# EAGLE design Tracksoar v1.2 active gps (EAGLE 7.3.0)
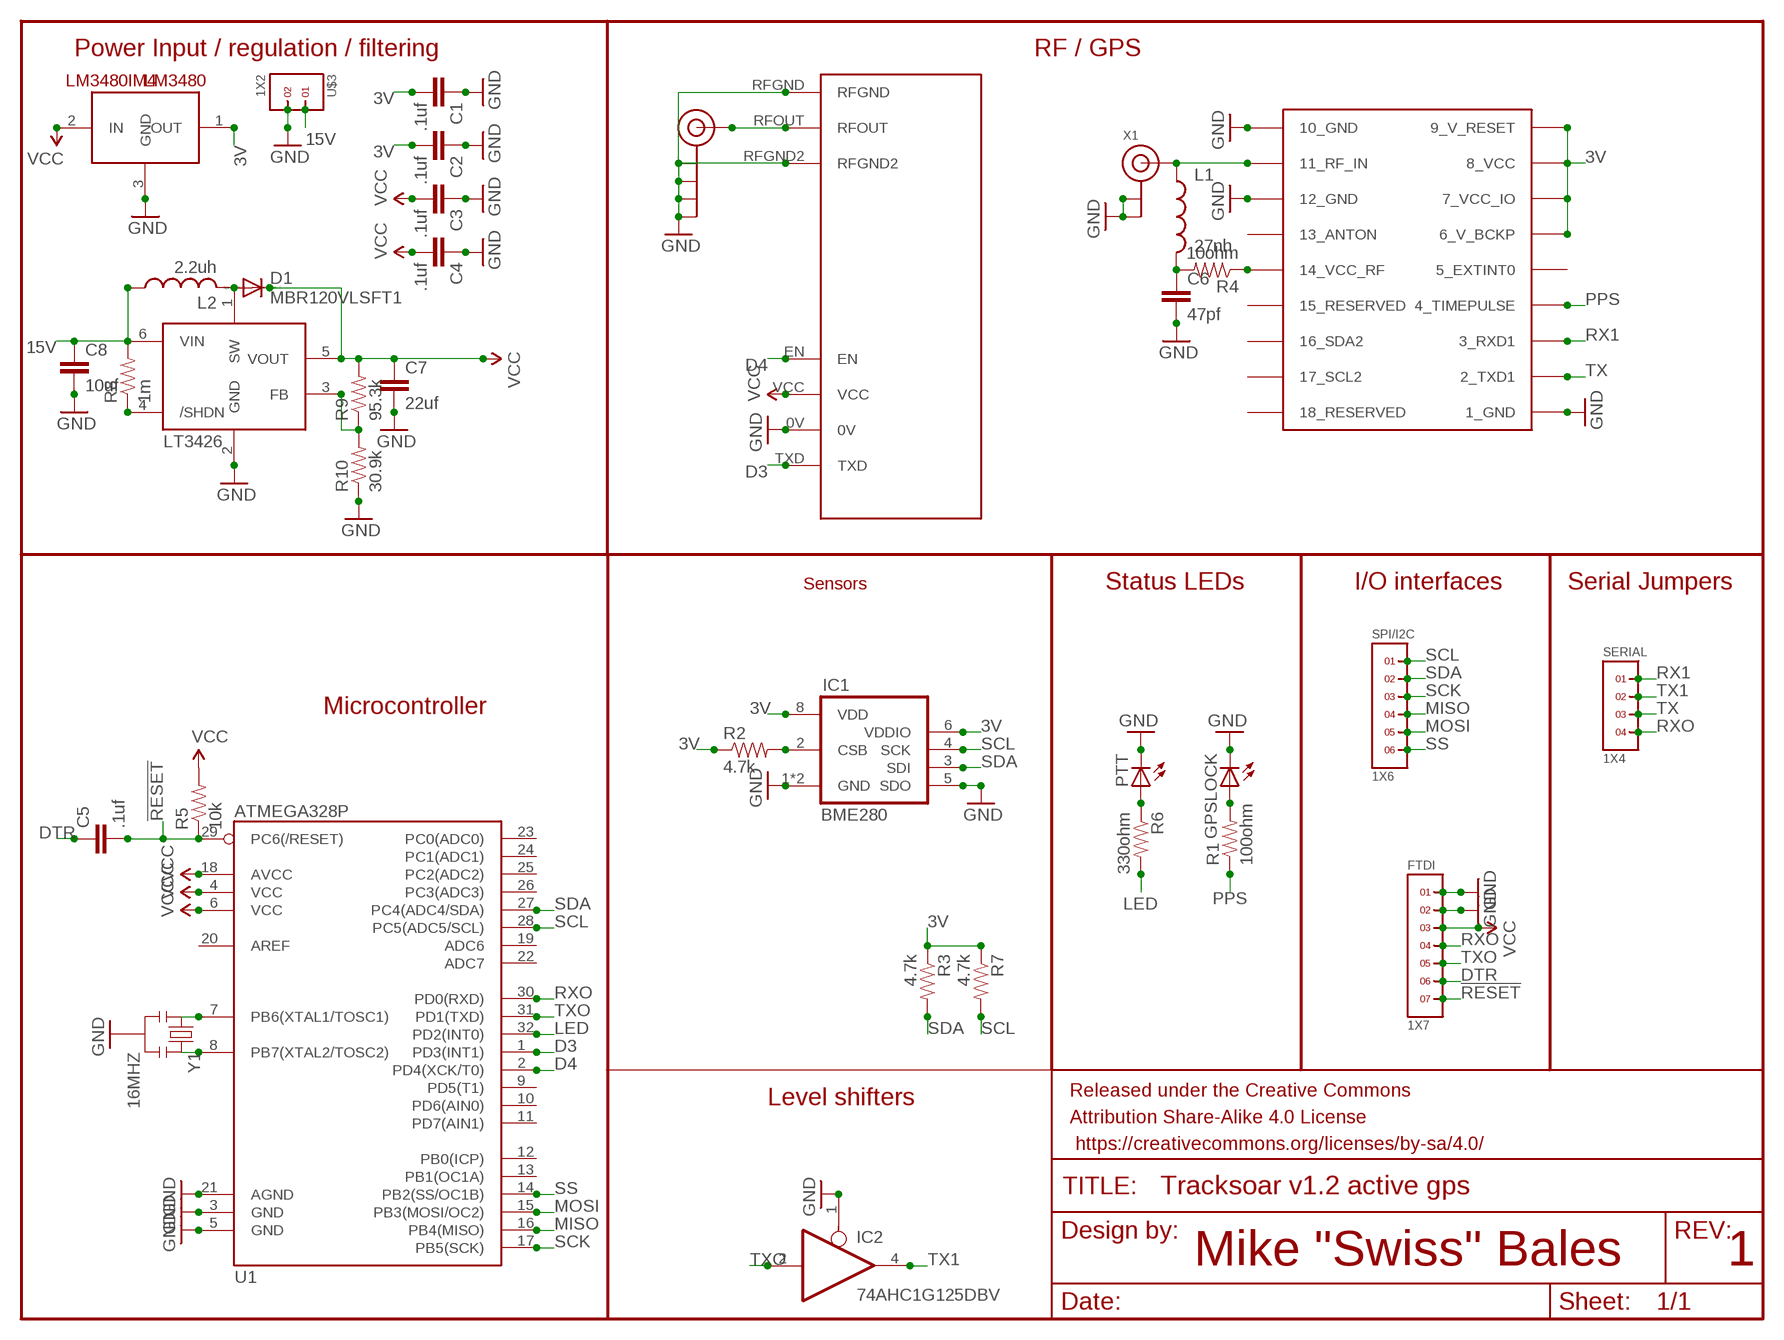
[diagram p0: schematic, sheet 1]

## Parts
C1  .1uf  CAP0805  [0805]
C2  .1uf  CAP0805  [0805]
C3  .1uf  CAP0805  [0805]
C4  .1uf  CAP0805  [0805]
C5  .1uf  CAP0805  [0805]
C6  47pf  CAP0805  [0805]
C7  22uf  CAP0805  [0805]
C8  10uf  CAP0805  [0805]
D1  MBR120VLSFT1  DIODE-SOD123  [SOD123]
FRAME1  FRAME-LETTER  [CREATIVE_COMMONS]
FTDI  1X7  [1X7]
GPSLOCK  LEDCHIP-LED0805  [CHIP-LED0805]
IC1  BME280  [BME280]
IC2  74AHC1G125DBV  [SOT23-5]
J$1  SMA_EDGE  [SMA-EDGE]
L1  27nh  INDUCTOR0805  [0805]
L2  2.2uh  L-USL1812  [L1812]
LM3480  LM3480IM4  [SOT23-3]
LT3426  LT3426  [SOT23-6]
PTT  LEDCHIP-LED0805  [CHIP-LED0805]
R1  100ohm  RESISTOR0805-RES  [0805]
R2  4.7k  RESISTOR0805-RES  [0805]
R3  4.7k  RESISTOR0805-RES  [0805]
R4  10ohm  RESISTOR0805-RES  [0805]
R5  10k  RESISTOR0805-RES  [0805]
R6  330ohm  RESISTOR0805-RES  [0805]
R7  4.7k  RESISTOR0805-RES  [0805]
R8  1m  RESISTOR0805-RES  [0805]
R9  95.3k  RESISTOR0805-RES  [0805]
R10  30.9k  RESISTOR0805-RES  [0805]
SERIAL  1X4  [1X4]
SPI/I2C  1X6  [1X6]
U1  ATMEGA328P  ATMEGA168MLF  [MLF32]
U$1  UBLOX_MAX  [UBLOX_MAX]
U$2  RADIOMETRIX-HX1  [RADIOMETRIX-HX1]
U$3  1X2  [1X2]
X1  ANTENNA_U.FL  [U.FL]
Y1  16MHZ  RESONATOR16MHZ  [RESONATOR-SMD]

## Nets
3V: C1.2 C2.2 IC1.6(VDDIO) IC1.8(VDD) LM3480.1(OUT) R2.1 R3.1 R7.1 U$1.6_V_BCKP U$1.7_VCC_IO U$1.8_VCC U$1.9_V_RESET
15V: C8.1 L2.1 LT3426.6(VIN) R8.2 U$3.1
!RESET: C5.2 FTDI.7 R5.1 U1.29(PC6(/RESET))
D3: U1.1(PD3(INT1)) U$2.TXD
D4: U1.2(PD4(XCK/T0)) U$2.EN
DTR: C5.1 FTDI.6
GND: C1.1 C2.1 C3.1 C4.1 C6.2 C7.2 C8.2 FTDI.1 FTDI.2 GPSLOCK.C IC1.1(GND) IC1.5(SDO) IC1.7(GND) IC2.1(OE) J$1.GND@0(GND) J$1.GND@1(GND) J$1.GND@2(GND) J$1.GND@3(GND) LM3480.3(GND) LT3426.2(GND) PTT.C R10.1 U1.3(GND) U1.5(GND) U1.21(AGND) U$1.1_GND U$1.10_GND U$1.12_GND U$2.0V U$2.RFGND U$2.RFGND2 U$3.2 X1.1(GND) X1.2(GND) Y1.2
LED: R6.2 U1.32(PD2(INT0))
MISO: SPI/I2C.4 U1.16(PB4(MISO))
MOSI: SPI/I2C.5 U1.15(PB3(MOSI/OC2))
N$1: J$1.SIG(SIGNAL) U$2.RFOUT
N$2: IC1.2(CSB) R2.2
N$3: GPSLOCK.A R1.2
N$6: L1.1 U$1.11_RF_IN X1.3(SIGNAL)
N$7: C6.1 L1.2 R4.2
N$8: R4.1 U$1.14_VCC_RF
N$9: D1.A L2.2 LT3426.1(SW)
N$12: LT3426.4(/SHDN) R8.1
N$13: LT3426.3(FB) R9.1 R10.2
N$14: U1.8(PB7(XTAL2/TOSC2)) Y1.3
N$26: U1.7(PB6(XTAL1/TOSC1)) Y1.1
N$27: PTT.A R6.1
PPS: R1.1 U$1.4_TIMEPULSE
RX1: SERIAL.1 U$1.3_RXD1
RXO: FTDI.4 SERIAL.4 U1.30(PD0(RXD))
SCK: SPI/I2C.3 U1.17(PB5(SCK))
SCL: IC1.4(SCK) R7.2 SPI/I2C.1 U1.28(PC5(ADC5/SCL))
SDA: IC1.3(SDI) R3.2 SPI/I2C.2 U1.27(PC4(ADC4/SDA))
SS: SPI/I2C.6 U1.14(PB2(SS/OC1B))
TX: SERIAL.3 U$1.2_TXD1
TX1: IC2.4(O) SERIAL.2
TXO: FTDI.5 IC2.2(I) U1.31(PD1(TXD))
VCC: C3.2 C4.2 C7.1 D1.C FTDI.3 LM3480.2(IN) LT3426.5(VOUT) R5.2 R9.2 U1.4(VCC) U1.6(VCC) U1.18(AVCC) U$2.VCC
Unconnected: U1.9(PD5(T1)) U1.10(PD6(AIN0)) U1.11(PD7(AIN1)) U1.12(PB0(ICP)) U1.13(PB1(OC1A)) U1.19(ADC6) U1.20(AREF) U1.22(ADC7) U1.23(PC0(ADC0)) U1.24(PC1(ADC1)) U1.25(PC2(ADC2)) U1.26(PC3(ADC3)) U$1.5_EXTINT0 U$1.13_ANTON U$1.15_RESERVED U$1.16_SDA2 U$1.17_SCL2 U$1.18_RESERVED

## Notes on the sheet
- Power Input / regulation / filtering | RF / GPS
- Sensors | Status LEDs | I/O interfaces | Serial Jumpers
- Microcontroller
- Level shifters
- Mike "Swiss" Bales | 1

## Power pins joined to a net without a drawn wire
GND: IC2.3(GND)
VCC: IC2.5(VCC)

## Library data of the parts
C1-C5 C7 C8 = SparkFun-Capacitors:CAP: Capacitor Standard 0603 ceramic capacitor, and 0.1" leaded capacitor.
C6 = SparkFun-Passives:CAP: Capacitor Standard 0603 ceramic capacitor, and 0.1" leaded capacitor.
D1 = diode:DIODE-: DIODE
FRAME1 = SparkFun-Aesthetics:FRAME-LETTER: Schematic Frame Standard 8.5x11 US Letter frame
FTDI = headers(2mm):1X7
GPSLOCK PTT = adafruit:LED: LED OSRAM: - CHIPLED LG R971, LG N971, LY N971, LG Q971, LY Q971, LO R971, LY R971 LH N974, LH R974 LS Q976, LO Q976, LY Q976 LO Q996 - Hyper CHIPLED LW Q18S LB Q993, LB Q99A, LB R99A - SideLED LS A670, LO A670, LY A670, LG A670, LP A670 LB A673, LV A673, LT A673, LW A673 LH A674 LY A675 LS A676, LA A676, LO A676, LY A676, LW A676 LS A679, LY A679, LG A679 - Hyper Micro SIDELED® LS Y876, LA Y876, LO Y876, LY Y876 LT Y87S - SmartLED LW L88C, LW L88S LB L89C, LB L89S, LG L890 LS L89K, LO L89K, LY L89K LS L896, LA L896, LO L896, LY L896 - TOPLED LS T670, LO T670, LY T670, LG T670, LP T670 LSG T670, LSP T670, LSY T670, LOP T670, LYG T670 LG T671, LOG T671, LSG T671 LB T673, LV T673, LT T673, LW T673 LH T674 LS T676, LA T676, LO T676, LY T676, LB T676, LH T676, LSB T676, LW T676 LB T67C, LV T67C, LT T67C, LS T67K, LO T67K, LY T67K, LW E67C LS E67B, LA E67B, LO E67B, LY E67B, LB E67C, LV E67C, LT E67C LW T67C LS T679, LY T679, LG T679 LS T770, LO T770, LY T770, LG T770, LP T770 LB T773, LV T773, LT T773, LW T773 LH T774 LS E675, LA E675, LY E675, LS T675 LS T776, LA T776, LO T776, LY T776, LB T776 LHGB T686 LT T68C, LB T68C - Hyper Mini TOPLED® LB M676 - Mini TOPLED Santana® LG M470 LS M47K, LO M47K, LY M47K Source: http://www.osram.convergy.de/
IC1 = bosch-bme280:BME280: DIGITAL HUMIDITY, PRESSURE AND TEMPERATURE SENSOR * Digital interface I²C (up to 3.4 MHz) and SPI (3 and 4 wire, up to 10 MHz)* Supply voltage VDD main supply voltage range: 1.71 V to 3.6 V*VDDIO interface voltage range: 1.2 V to 3.6 V Operating range -40…+85 °C, 0…100 % rel. humidity, 300…1100 hPa The library has been designed by Richard Magdycz <https://www.facebook.com/groups/eaglecadsoftUK>
IC2 = 74xx-little-us:74*1G125: Single Bus Buffer Gate with 3-State Output
J$1 = SparkFun-Connectors:SMA_EDGE: SMA Antenna Connector End launch SMA connector. The paste layer has been removed so that the connector can be hand soldered onto the board after reflow.
L1 = SparkFun-Passives:INDUCTOR: Inductors Basic Inductor/Choke - 0603 and 1206. Footprints are not proven and vary greatly between part numbers. INDUCTOR POWER 3.3UH 4.0A SMD 0.197" L x 0.197" W x 0.177" H (5.00mm x 5.00mm x 4.50mm)
L2 = resistor:L-US: INDUCTOR, American symbol
LM3480 = SparkFun-PowerIC:LM3480IM4: Small package linear regulator
LT3426 = adafruit:LT3426: LT3426 1.2MHz, 2A boost converter in SOT-23 http://www.linear.com/pc/productDetail.jsp?navId=H0,C1,C1003,C1042,C1031,C1061,P8430 (Linear website)
R1-R3 R5-R10 = SparkFun-Resistors:RESISTOR: Resistor Basic schematic elements and footprints for 0603, 1206, and PTH resistors.
R4 = SparkFun-Passives:RESISTOR: Resistor Basic schematic elements and footprints for 0603, 1206, and PTH resistors.
SERIAL = headers(2mm):1X4
SPI/I2C = headers(2mm):1X6
U1 = SparkFun-DigitalIC:ATMEGA168: Atmel 32-pin 8-bit micro, 16k flash.
U$1 = Ava:UBLOX_MAX: UBLOX MAX
U$2 = Ava:RADIOMETRIX-HX1
U$3 = headers(2mm):1X2
X1 = adafruit:ANTENNA_U.FL: U.FL Antenna Connector
Y1 = SparkFun-FreqCtrl:RESONATOR: Resonator Small SMD resonator. Used, eg, on the Arduino Pro/ Pro Mini boards. 8MHz- XTAL-08895 16MHz- XTAL-08900; PROD_ID: XTAL-08900

## Board
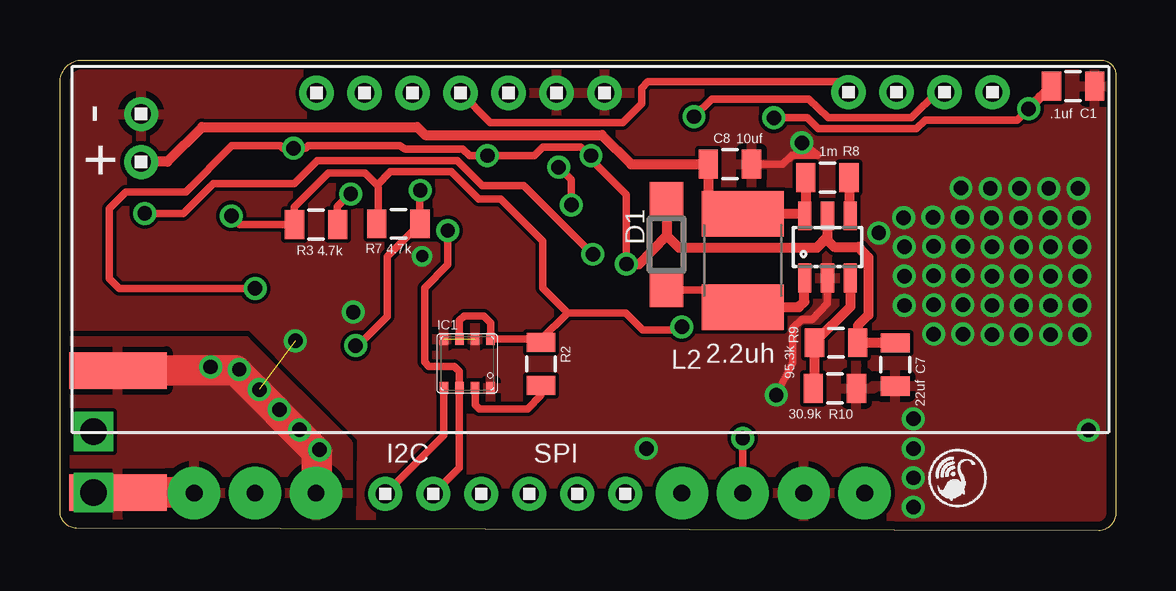
[diagram p1: board, top side]
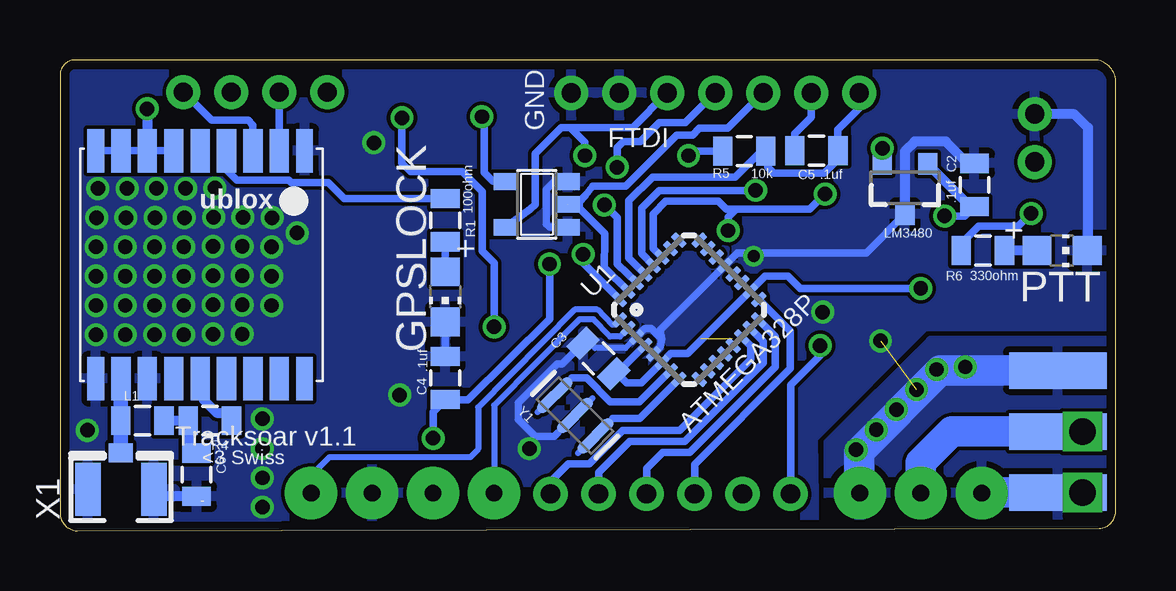
[diagram p2: board, bottom side, seen from below]

Size 43.99 x 19.64 mm. Coordinates in mm from the lower left corner, seen from the top.
Outline: 0.69,0.1 arc-90 0,0.86 0,18.77 arc-90 0.99,19.63 43.38,19.63 arc-90 43.99,18.97 43.99,0.79 arc-90 43.28,0 0.69,0.1
Copper layers (1*16): Top 0.0356mm / dielectric 1.5011mm / Bottom 0.0356mm
Design rules "oshpark-2layer": minimum track width 6mil, minimum drill 13mil, track to track 6mil, track to pad 6mil, pad to pad 6mil, via to via 6mil, smd to smd 6mil, copper to edge 15mil, drill to drill 6mil, minimum pad ring 7mil, minimum via ring 7mil, stop-mask expansion 4mil, vias tented up to drill 0mil, thermal gap 10mil

### Footprints (pad centres in the part's own frame; a part is rotated, then mirrored left to right if it is on the bottom)
0805 = smd 0.8 x 1.2: 1 -0.9,0; 2 0.9,0
SOD123 = smd 1.4 x 1.4: A 1.9,0; C -1.9,0
1X7 = drill 0.8 pad 1.422: 1 -6,0; 2 -4,0; 3 -2,0; 4 0,0; 5 2,0; 6 4,0; 7 6,0
CHIP-LED0805 = smd 1.2 x 1.2: A 0,-1.05; C 0,1.05
BME280 = smd 0.35 x 0.5: 1 0.975,-1.025; 2 0.325,-1.025; 3 -0.325,-1.025; 4 -0.975,-1.025; 5 -0.975,1.025; 6 -0.325,1.025; 7 0.325,1.025; 8 0.975,1.025
SOT23-5 = smd 0.69 x 0.99: 1 -0.95,-1.29; 2 0,-1.29; 3 0.95,-1.29; 4 0.95,1.3; 5 -0.95,1.3
SMA-EDGE = smd 1.524 x 4.064: GND@0 0,0; GND@1 5.08,0; SIG 2.54,0 | smd 1.524 x 4.064 bottom: GND@2 0,0; GND@3 5.08,0
L1812 = smd 1.9 x 3.4: 1 -1.95,0; 2 1.95,0
SOT23-3 = smd 0.8 x 0.9: 1 -0.95,-1; 2 0.95,-1; 3 0,1.1
SOT23-6 = smd 0.55 x 1.2: 1 -0.95,-1.3; 2 0,-1.3; 3 0.95,-1.3; 4 0.95,1.3; 5 0,1.3; 6 -0.95,1.3
1X4 = drill 0.8 pad 1.422: 1 -3,0; 2 -1,0; 3 1,0; 4 3,0
1X6 = drill 0.8 pad 1.422: 1 -5,0; 2 -3,0; 3 -1,0; 4 1,0; 5 3,0; 6 5,0
MLF32 = smd 0.7 x 0.3: 1 -2.35,1.75; 2 -2.35,1.25; 3 -2.35,0.75; 4 -2.35,0.25; 5 -2.35,-0.25; 6 -2.35,-0.75; 7 -2.35,-1.25; 8 -2.35,-1.75; 17 2.35,-1.75; 18 2.35,-1.25; 19 2.35,-0.75; 20 2.35,-0.25; 21 2.35,0.25; 22 2.35,0.75; 23 2.35,1.25; 24 2.35,1.75 | smd 0.3 x 0.7: 9 -1.75,-2.35; 10 -1.25,-2.35; 11 -0.75,-2.35; 12 -0.25,-2.35; 13 0.25,-2.35; 14 0.75,-2.35; 15 1.25,-2.35; 16 1.75,-2.35; 25 1.75,2.35; 26 1.25,2.35; 27 0.75,2.35; 28 0.25,2.35; 29 -0.25,2.35; 30 -0.75,2.35; 31 -1.25,2.35; 32 -1.75,2.35
UBLOX_MAX = smd 1.8 x 0.7: 1_GND 4.95,-4.4; 9_V_RESET 4.95,4.3; 10_GND -4.55,4.3; 18_RESERVED -4.55,-4.4 | smd 1.8 x 0.8: 2_TXD1 4.95,-3.35; 3_RXD1 4.95,-2.25; 4_TIMEPULSE 4.95,-1.15; 5_EXTINT0 4.95,-0.05; 6_V_BCKP 4.95,1.05; 7_VCC_IO 4.95,2.15; 8_VCC 4.95,3.25; 11_RF_IN -4.55,3.25; 12_GND -4.55,2.15; 13_ANTON -4.55,1.05; 14_VCC_RF -4.55,-0.05; 15_RESERVED -4.55,-1.15; 16_SDA2 -4.55,-2.25; 17_SCL2 -4.55,-3.35
RADIOMETRIX-HX1 = drill 0.7 pad 2.184: 0V 8.89,-10.16; EN 3.81,-10.16; RFGND -11.43,-10.16; RFGND2 -16.51,-10.16; RFOUT -13.97,-10.16; TXD 11.43,-10.16; VCC 6.35,-10.16
1X2 = drill 0.8 pad 1.422: 1 -1,0; 2 1,0
U.FL = smd 2.2 x 1.05: 1 0,1.375; 2 0,-1.375 | smd 0.8 x 1: 3 1.525,0
RESONATOR-SMD = smd 0.45 x 1.905: 1 -1.2,0; 2 0,0; 3 1.2,0

### Placement (x,y rotation side)
C1  42.22,18.54 180 top
C2  5.89,14.43 270 bottom
C3  21.57,7.19 315 bottom
C4  27.94,6.38 270 bottom
C5  12.48,15.86 0 bottom
C6  38.3,2.34 270 bottom
C7  34.8,6.93 270 top
C8  27.92,15.29 0 top
D1  25.27,11.94 270 top
FRAME1  14.35,-8.08 0 top  (outside the outline)
FTDI  16.69,18.26 180 top
GPSLOCK  27.94,9.75 180 bottom
IC1  16.97,6.99 0 top
IC2  24.13,13.61 90 bottom
J$1  2.41,1.6 90 bottom
L1  40.56,4.6 0 bottom
L2  28.45,11.28 270 top
LM3480  8.79,14.3 180 bottom
LT3426  31.98,11.84 0 top
PTT  2.24,11.68 270 bottom
R1  27.94,12.95 270 bottom
R2  20.04,6.96 270 top
R3  10.67,12.78 0 top
R4  37.74,4.6 180 bottom
R5  15.48,15.84 180 bottom
R6  5.54,11.68 180 bottom
R7  14.1,12.8 0 top
R8  31.98,14.73 180 top
R9  32.33,7.85 0 top
R10  32.28,5.94 180 top
SERIAL  35.86,18.3 180 top
SPI/I2C  18.56,1.54 0 top
U1  17.78,9.22 45 bottom
U$1  38.2,10.9 90 bottom
U$2  22.1,11.73 0 top
U$3  3.38,16.38 90 top
X1  41.45,1.73 90 bottom
Y1  22.53,4.81 315 bottom

### Tracks (layer width: path | path; a pad name or v marks a point on that pad's centre or on a via)
3V  (via drill 0.6)
  Top 0.305: R3.1 7.49,12.78 v7.14,13.13 | R3.1 9.77,13.5 11.18,14.91 12.73,14.91 13.21,14.43 | 13.21,14.43 13.26,14.31 13.26,12.86 R7.1 | 13.21,14.43 13.77,14.99 16.31,14.99 17.45,13.84 18.37,13.84 20.12,12.09 20.12,10.13 21.16,9.09 | 9.78,12.77 R3.1 | 21.16,9.09 23.57,9.09 24.28,8.38 25.78,8.38 v25.91,8.51 | 40.89,18.1 C1.2 | v40.36,17.6 39.88,17.12 36.04,17.12 35.69,16.76 31.6,16.76 31.14,17.22 v29.74,17.22 | IC1.6 16.64,8.76 16.84,8.97 17.65,8.97 17.94,8.68 IC1.8 19.89,8.01 R2.1 20.04,7.98 21.16,9.09
  Top 0.406: C1.2 40.84,18.09 v40.36,17.6
  Bottom 0.305: U$1.9_V_RESET U$1.8_VCC U$1.7_VCC_IO U$1.6_V_BCKP 39.27,15.83 | v7.14,13.13 6.29,13.13 C2.2 | v25.91,8.51 25.91,11.18 26.39,11.66 26.39,14.15 27.23,14.99 29.39,14.99 29.74,15.34 v29.74,17.22
  Bottom 0.406: C2.2 6.07,13.53 LM3480.1 | v40.36,17.6 U$1.7_VCC_IO
15V
  Top 0.406: R8.2 31.08,13.19 LT3426.6 30.94,13.23 L2.1 28.43,13.21 27.76,13.21 27.02,13.96 C8.1 23.8,15.29 22.58,16.51 15.22,16.51 14.89,16.84 5.92,16.84 4.47,15.39 3.39,15.39 U$3.1
!RESET
  Bottom 0.305: U1.29 20.3,11.38 20.3,13.77 19.3,14.76 15.85,14.76 14.77,15.84 R5.1 14.5,15.16 14.25,14.91 12.14,14.91 11.58,15.47 C5.2 11.58,16.74 10.69,17.63 FTDI.7
D3
  Bottom 0.254: U1.1 20.89,8.59 20.98,8.59 21.59,9.22 22.56,9.22 26.57,5.16 26.57,3.4 26.9,3.07 32.77,3.07 33.53,2.31 U$2.TXD
D4
  Bottom 0.254: U1.2 20.67,8.1 21.08,8.1 21.77,8.81 22.35,8.81 25.91,5.23 U$2.EN
DTR
  Bottom 0.305: FTDI.6 12.69,17.26 13.39,16.56 13.39,15.87
  Bottom 0.406: 13.39,15.87 C5.1
GND  (via drill 0.5, 0.6, 1.1)  (2 unrouted)
  Top 0.305: LT3426.2 31.98,9.47 31.34,8.81 30.91,8.81 30.53,8.46 30.53,7.01 v29.85,5.66 | C8.2 30.13,15.29 30.51,15.67 31.57,15.67 v30.91,16.18
  Top 0.406: U$2.RFGND2 5.61,1.58 5.61,1.6
  Top 1.27: J$1.GND@1 7.32,6.68 10.69,3.3 10.69,1.6 U$2.RFGND | 2.31,1.6 5.61,1.6
  Bottom 0.254: U1.3 20.44,7.62 21.69,7.62 21.9,7.82 C3.1
  Bottom 0.305: U1.5 18.97,7.67 18.92,8 | 18.92,8 19.36,8.43 19.63,8.43 U1.3 | 18.92,8 18.97,8.38 U1.21 15.77,11.58 10.41,11.58 LM3480.3 | GPSLOCK.C C4.1 | 22.85,14.59 IC2.3 22.85,14.55 23.39,14.55 23.72,14.22 23.72,12.8 23.59,12.66 IC2.1 | C3.1 23.07,6.96 23.27,6.96 24.89,5.33 24.89,4.65 24.18,3.94 23.41,3.94 23.25,4.09
  Bottom 0.406: PTT.C 1.17,11.7 1.17,16.82 1.73,17.37 3.37,17.37 U$3.2 | 5.84,15.38 C2.1 6.18,15.33 7.09,16.23 8.38,16.23 8.79,15.82 LM3480.3 | C6.2 39.79,1.44 X1.2
  Bottom 1.27: U$2.RFGND2 5.56,1.6 J$1.GND@2 | J$1.GND@1 7.32,6.68 10.69,3.3 10.69,1.6 U$2.RFGND
  other vias: 9.8,7.92 15.09,11.46 12.22,9.12 1.4,1.6 24.44,3.43 42.49,8.18 41.28,8.18 40.06,8.18 38.84,8.18 37.62,8.2 36.4,8.2 42.49,9.4 41.28,9.4 40.06,9.4 38.84,9.4 37.62,9.42 36.4,9.42 35.18,9.4 42.49,10.62 41.28,10.62 40.06,10.62 38.84,10.62 37.62,10.64 36.4,10.64 35.18,10.62 42.49,11.84 41.28,11.84 40.06,11.84 38.84,11.84 37.62,11.86 36.4,11.86 35.18,11.84 42.47,13.06 41.25,13.06 40.03,13.06 38.81,13.06 41.2,14.27 39.98,14.27 42.42,14.27 37.59,13.08 36.37,13.08 35.15,13.06 34.11,12.42 38.76,14.27 37.54,14.3 6.27,6.83 7.47,6.73 8.31,5.89 9.14,5.05 9.98,4.22 10.82,3.38 42.85,4.19 35.56,4.67 35.56,3.43 35.56,2.21 35.56,0.99
  pour Top: 0,19.66 44.02,19.66 44.02,0.08 12.55,0.1 12.6,3.86 7.95,8.53 0,8.53
  pour Bottom: 0,19.66 44.02,19.66 44.02,0.08 12.55,0.1 12.6,3.86 7.95,8.53 0,8.53
  pour Bottom: 0,7.92 7.72,7.92 11.99,3.66 11.99,0.1 0,0.1
  pour Top: 0,7.92 7.72,7.92 11.99,3.66 11.99,0.1 0,0.1
LED  (via drill 0.6)
  Top 0.305: v3.53,13.23 5.13,13.23 6.38,14.48 9.75,14.48 10.72,15.44 16.56,15.44 17.6,14.4 19.33,14.4 v22.2,11.53
  Bottom 0.305: R6.2 6.44,11.98 5.72,12.7 4.06,12.7 v3.53,13.23 | v22.2,11.53 22.2,11.17 U1.32
MISO
  Bottom 0.305: U1.16 14.2,8.11 14.2,6.83 17.76,3.28 18.87,3.28 19.55,2.6 SPI/I2C.4
MOSI
  Bottom 0.305: U1.15 14.68,7.89 14.68,7.01 17.96,3.73 20.24,3.73 21.55,2.43 SPI/I2C.5
N$1
  Bottom 1.27: J$1.SIG 6.83,4.14 8.13,2.85 U$2.RFOUT
N$2
  Top 0.305: R2.2 20.04,5.64 19.48,5.08 17.48,5.08 17.3,5.26 IC1.2
N$3
  Bottom 0.305: R1.2 GPSLOCK.A
N$6
  Bottom 0.406: L1.1 X1.3
  Bottom 0.61: U$1.11_RF_IN X1.3
N$7
  Bottom 0.406: L1.2 R4.2 38.65,3.58 C6.1
N$8
  Bottom 0.406: U$1.14_VCC_RF 37.98,6.35 37.98,5.45 37.47,4.93 37.18,4.93 R4.1
N$9
  Top 0.305: D1.A 27.74,10.04 L2.2
  Top 0.406: L2.2 30.79,9.33 31.01,9.55 31.01,10.52 LT3426.1
N$12
  Top 0.406: R8.1 32.88,13.19 LT3426.4
N$13
  Top 0.406: LT3426.3 32.93,9.34 R9.1 31.44,5.99 R10.2
N$14
  Bottom 0.305: U1.8 19.85,4.68 20.97,4.68
N$18  (via drill 1.1)
  other vias: 1.4,4.14
N$26
  Bottom 0.305: U1.7 19.85,5.39 21.06,5.39 22.05,6.38 22.66,6.38
N$27
  Bottom 0.406: PTT.A R6.1
PPS
  Bottom 0.305: R1.1 32.14,13.85 32.82,14.53 34.37,14.53 34.47,14.63 36.63,14.63 37.06,15.06 U$1.4_TIMEPULSE
RX1
  Bottom 0.305: U$1.3_RXD1 35.95,16.93 36.15,17.12 37.67,17.12 SERIAL.1
RXO  (via drill 0.6)
  Top 0.305: v21.31,13.59 21.31,14.66 v20.78,15.16 | FTDI.4 17.93,17.02 23.45,17.02 24.23,17.81 24.23,18.47 24.49,18.72 32.43,18.72 SERIAL.4 32.86,18.31
  Bottom 0.305: U1.30 20.78,11.13 20.78,13.06 v21.31,13.59 | v20.78,15.16 20.78,15.98 20.52,16.23 19.81,16.23 19.03,17.02 17.93,17.02 FTDI.4
SCK
  Bottom 0.305: U1.17 13.56,8.33 13.56,6.78 17.55,2.77 SPI/I2C.3
SCL  (via drill 0.6)
  Top 0.305: R7.2 15,13.7 v15.01,14.2 | 15.24,12.8 R7.2 | R7.2 15.07,12.58 | IC1.4 15.99,3.97 SPI/I2C.1 | v12.32,7.72 12.42,7.72 13.64,8.94 13.64,11.44 R7.2
  Bottom 0.305: U1.28 19.76,11.56 19.76,13.46 19.03,14.2 v15.01,14.2 | v12.32,7.72 12.32,7.32 13.56,6.08 SPI/I2C.1 | SPI/I2C.1
SDA  (via drill 0.6)
  Top 0.305: v12.12,14.05 12.09,14.05 11.56,13.51 11.56,12.79 R3.2 | SPI/I2C.2 16.64,2.62 IC1.3 16.64,6.65 16.43,6.86 15.37,6.86 15.19,7.04 15.19,10.13 16.16,11.1 v16.16,12.52
  Bottom 0.305: U1.27 19.28,11.78 19.28,13.21 18.75,13.74 16.56,13.74 16.23,13.41 15.83,13.41 | 15.83,13.41 12.75,13.41 v12.12,14.05 | v16.16,12.52 16.16,13.08 15.83,13.41
SS
  Bottom 0.305: U1.14 15.22,7.72 15.22,7.14 18.16,4.19 20.55,4.19 21.95,2.79 22.81,2.79 23.55,2.05 SPI/I2C.6
TX
  Bottom 0.305: U$1.2_TXD1 SERIAL.3
TX1  (via drill 0.6)
  Top 0.305: SERIAL.2 36.56,18.3 35.46,17.22 32,17.22 31.19,18.01 27.15,18.01 v26.42,17.27
  Bottom 0.305: IC2.4 25.89,14.59 25.97,14.59 26.32,14.94 26.32,17.17 v26.42,17.27
TXO
  Bottom 0.305: U1.31 21.31,10.98 21.29,12.19 21.29,12.4 22.35,13.46 | 22.35,13.46 22.66,13.46 IC2.2 | 22.35,13.46 22.35,13.72 22.1,13.97 21.79,14.38 20.42,14.38 18.29,16.51 17.63,16.51 17.35,16.79 16.16,16.79 FTDI.5
VCC  (via drill 0.6)
  Top 0.305: v8.13,10.11 2.46,10.11 2.06,10.52 2.06,13.44 2.74,14.12 5.23,14.12 7.16,16.05 9.17,16.05 9.27,15.95 v9.73,15.95 10.24,15.95 10.34,16.05 14.15,16.05 14.38,15.93 16.79,15.93 17.07,15.65 v17.81,15.65 19.76,15.65 20.12,16 21.69,16 v22.12,15.65 21.97,15.65 23.6,14.02 v23.6,11.13 | U$2.VCC v28.45,3.86
  Top 0.406: D1.C 25.27,12.32 | 25.27,12.32 25.78,11.81 31.55,11.81 31.98,12.24 LT3426.5 31.98,12.12 32.26,11.84 33.27,11.84 33.68,11.4 33.68,8.99 33.25,8.56 33.25,7.86 R9.2 33.25,7.83 C7.1 | v23.6,11.13 24.13,11.13 25.27,12.32
  Bottom 0.305: U1.4 20.75,6.6 C3.2 20.78,6.58 20.37,6.17 19.77,6.17 U1.6 18.54,7.39 17.84,7.39 U1.18 14.62,10.62 13.67,10.62 13.16,10.11 v8.13,10.11 | IC2.5 24.4,13.43 24.18,13.61 24.18,15.72 23.11,16.82 22.73,16.82 | 22.73,16.82 20.14,16.82 FTDI.3 | v9.73,15.95 9.73,15.31 LM3480.2 | R5.2 17.46,15.84 v17.81,15.65 | v22.12,15.65 22.12,16.21 22.73,16.82 | v28.45,3.86 28.45,4.97 C4.2 | C4.2 27.67,5.48 | v23.6,11.13 23.6,8.84 27,5.46 27.93,5.46 C4.2

### Text on the board
tNames: - | + | I2C | SPI
bNames: GND | FTDI | Tracksoar v1.1 | <3 Swiss